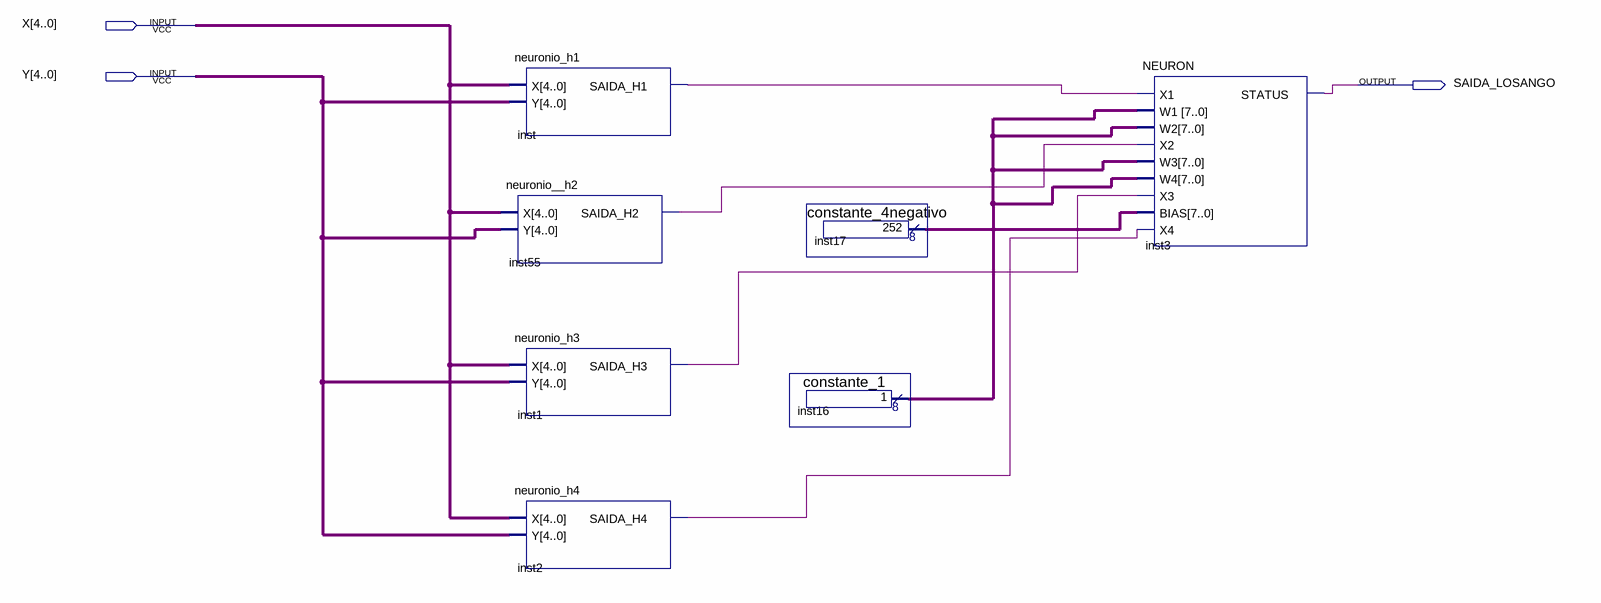
[diagram p0: schematic sheet]
// Quartus schematic mlp_losango.bdf as structural Verilog: 7 symbols, 3 pins
module mlp_losango (
  input  [4:0] X,
  input  [4:0] Y,
  output SAIDA_LOSANGO
);

  wire inst1_saida_h3, inst2_saida_h4, inst55_saida_h2, inst_saida_h1;
  wire [7:0] inst16_result, inst17_result;

  neuronio_h1 inst (.X(X), .Y(Y), .SAIDA_H1(inst_saida_h1));
  neuronio__h2 inst55 (.X(X), .Y(Y), .SAIDA_H2(inst55_saida_h2));
  neuronio_h3 inst1 (.X(X), .Y(Y), .SAIDA_H3(inst1_saida_h3));
  neuronio_h4 inst2 (.X(X), .Y(Y), .SAIDA_H4(inst2_saida_h4));
  constante_4negativo inst17 (.result(inst17_result));
  constante_1 inst16 (.result(inst16_result));
  NEURON inst3 (
    .X1(inst_saida_h1), .W1(inst16_result), .W2(inst16_result), .X2(inst55_saida_h2), .W3(inst16_result),
    .W4(inst16_result), .X3(inst1_saida_h3), .BIAS(inst17_result), .X4(inst2_saida_h4), .STATUS(SAIDA_LOSANGO));
endmodule
